# EasyEDA Pro project backup.epro, board PCB_Pre
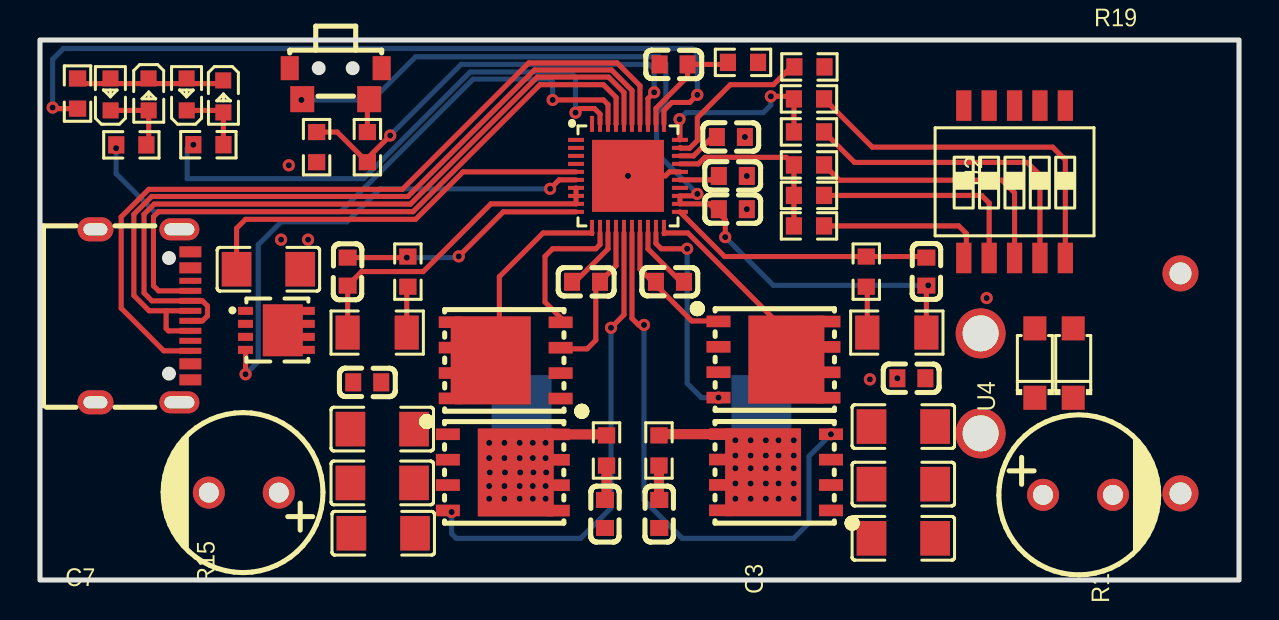
[diagram p10: board, top side]
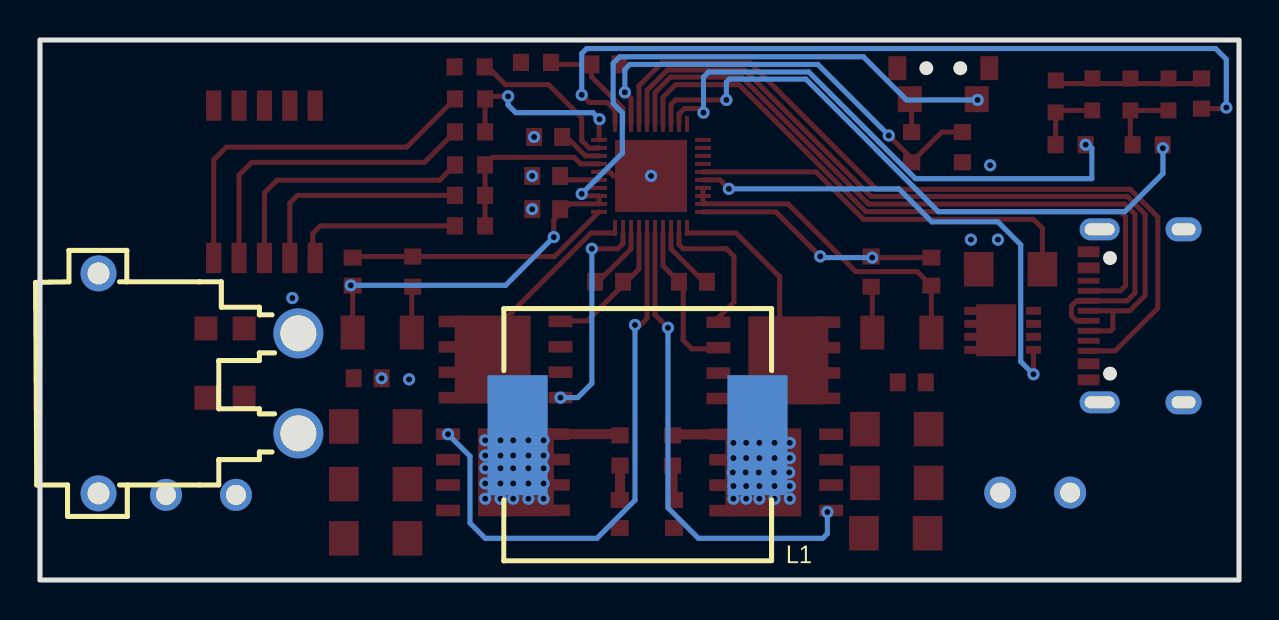
[diagram p11: board, bottom side, seen from below]

Outline 60 x 27 mm; copper layers: Top Layer, Inner1, Inner2, Bottom Layer. Coordinates in mm from the lower left corner of the outline.
Outline path: rectangle 0,27 60,0
Stack: Top Layer 0.035mm 外层铜厚1oz / Dielectric1 0.2104mm 7628 RC49% 8.6mil / Inner1 0.0152mm 内层铜厚 / Dielectric2 1.065mm 1.1mm H/HOZ 含铜 / Inner2 0.0152mm 内层铜厚 / Dielectric3 0.2104mm 7628 RC49% 8.6mil / Bottom Layer 0.035mm 外层铜厚1oz

## Design rules (mm)
template: 自定义配置
spacing copperThickness1oz (default): track to track 0.102, other pairs 0.152 to 0.3
spacing copperThickness2oz: track to track 0.203, other pairs 0.152 to 0.3
spacing 6mil: track to track 0.102, other pairs 0.152 to 0.152
track width copperThickness1oz (default): min 0.127, default 0.254, max 2.54
track width copperThickness2oz: min 0.203, default 0.254, max 2.54
track width 10mil: min 0.254, default 0.254, max 2.54
track width 20mil: min 0.508, default 0.508, max 2.54
differential pair differentialPair (default): width min 0.127, default 0.254, max 2.54; gap min 0.152, default 0.152
differential pair err=5mil: width min 0.127, default 0.254, max 2.54; gap min 0.152, default 0.254
via viaSize (default): diameter min 0.5, default 0.61, max 10; hole min 0.3, default 0.305, max 6.299
via 12-24: diameter min 0.5, default 0.61, max 10; hole min 0.3, default 0.305, max 6.299

## Placement (name value [footprint] x y rotation side)
C1  100nF  [C0603]  27.32 14.91 180 top
C2  100nF  [C0603]  31.52 14.91 0 top
C3  3.3nF  [C0603]  28.27 3.3 90 top
C4  3.3nF  [C0603]  30.99 3.3 90 top
C7  22uF  [C1206]  17.13 4.85 180 top
C8  22uF  [C1206]  17.18 2.34 180 top
C10  100nF  [C0603]  16.38 9.88 180 top
C11  22uF  [C1206]  17.13 7.55 180 top
C15  100nF  [C0603]  43.6 10.09 0 top
C17  22uF  [C1206]  43.2 4.79 0 top
C18  22uF  [C1206]  43.2 2.08 0 top
C19  22uF  [C1206]  43.2 7.67 0 top
C20  2.2uF  [C0603]  34.67 20.2 0 top
C21  2.2uF  [C0603]  34.67 18.54 0 top
C22  100nF  [C0603]  31.71 25.78 180 top
C23  2.2uF  [C0603]  34.57 22.15 0 top
C29  470nF  [C0603]  15.39 15.42 90 top
C30  470nF  [C0603]  44.35 15.42 270 top
C31  22uF  [C1206]  11.43 15.54 0 top
C32  100uF/50V  [CAP-TH_BD8.0-P3.50-D0.6-FD]  10.2 4.37 180 top
C33  100uF/50V  [CAP-TH_BD8.0-P3.50-D0.6-FD]  51.94 4.26 0 top
CN1  XT30PW-M  [CONN-TH_XT30PW-M]  52.07 9.83 270 bottom
L1  22uH  [IND-SMD_L13.45-W12.6]  30.1 7.24 0 bottom
LED1  NCD0603R1  [LED0603-RD_RED]  9.17 24.18 270 top
LED2  NCD0603R1  [LED0603-RD_RED]  7.34 24.28 90 top
LED3  NCD0603R1  [LED0603-RD_RED]  5.44 24.28 270 top
LED4  NCD0603R1  [LED0603-RD_RED]  3.53 24.28 90 top
Q1  RU3030M2  [PDFN3333-8_L3.1-W3.2-P0.65-LS3.4-BL]  11.82 12.48 270 top
R1  2Ω  [R0603]  28.35 6.48 90 top
R2  2Ω  [R0603]  30.97 6.48 90 top
R7  51Ω  [R0603]  18.41 15.42 90 top
R8  5mΩ  [R1206]  16.87 12.37 0 top
R9  10Ω  [R0603]  41.35 15.42 90 top
R10  5mΩ  [R1206]  42.88 12.37 0 top
R11  100Ω  [R0603]  8.43 21.76 0 top
R12  100Ω  [R0603]  4.57 21.76 0 top
R13  100Ω  [R0603]  1.88 24.32 90 top
R14  10kΩ  [R0603]  35.18 25.88 0 top
R15  43kΩ  [R0603]  16.38 21.64 270 top
R16  10kΩ  [R0603]  13.84 21.64 90 top
R17  27kΩ  [R0603]  38.5 25.65 0 top
R18  3.6kΩ  [R0603]  38.48 24.06 0 top
R19  9.1kΩ  [R0603]  38.48 22.4 0 top
R20  27kΩ  [R0603]  38.48 20.75 0 top
R21  13kΩ  [R0603]  38.48 19.23 0 top
R22  9.1kΩ  [R0603]  38.48 17.7 0 top
SW1  TS24CA  [SW-SMD_TS24CA]  14.8 24.82 0 top
U1  -  [IP2366]  26.92 17.71 0 top
U2  AGM40P100A  [DFN-8_L5.8-W4.9-P1.27-LS6.0-BL-1]  23.3 10.98 90 top
U3  AGM40P100A  [DFN-8_L5.8-W4.9-P1.27-LS6.0-BL-1]  36.7 11.02 270 top
U4  AGM40P100A  [DFN-8_L5.8-W4.9-P1.27-LS6.0-BL-1]  23.16 5.38 270 top
U5  AGM40P100A  [DFN-8_L5.8-W4.9-P1.27-LS6.0-BL-1]  36.83 5.39 90 top
U7  SMF30A  [SOD-123FL_L2.7-W1.8-LS3.7-RD]  49.78 10.85 90 top
U8  SMF30A  [SOD-123FL_L2.7-W1.8-LS3.7-RD]  51.7 10.85 90 top
U9  DSHP05TSGER  [SW-SMD_10P-P1.27-L7.8-W5.4]  48.77 19.91 0 top
USB1  TYPE-C 16PIN 2MD(073)  [USB-C-SMD_TYPE-C-6PIN-2MD-073]  5.15 13.21 270 top

## Footprints (pads in the part's own frame, mm; a bottom-side part is the same pattern mirrored in y, then rotated)
C0603
  rect 0.8x0.9 smd: 1(-0.7,0) 2(0.7,0)
C1206
  rect 1.485x1.728 smd: 1(-1.593,0) 2(1.593,0)
CAP-TH_BD8.0-P3.50-D0.6-FD
  round 1.6 hole 1: 1(-1.75,0) 2(1.75,0)
CONN-TH_XT30PW-M
  round 2.5 hole 1.8: 1(-2.5,5) 2(2.5,5)
  round 1.8 hole 1.1: 3(5.5,-5) 4(-5.5,-5)
DFN-8_L5.8-W4.9-P1.27-LS6.0-BL-1
  rect 0.58x1.2 smd: 1(-1.907,-2.75) 2(-0.637,-2.75) 3(0.632,-2.75) 4(1.903,-2.75) 5(1.907,2.75) 6(0.637,2.75) 7(-0.632,2.75) 8(-1.903,2.75)
  rect 4.4x3.8 smd: 9(0,0.646)
IND-SMD_L13.45-W12.6
  rect 3x6 smd: 1(-6,0) 2(6,0)
IP2366
  rect 0.8x0.2 smd: 1(-0.1,4.3) 2(-0.1,3.9) 3(-0.1,3.5) 4(-0.1,3.1) 5(-0.1,2.7) 6(-0.1,2.3) 7(-0.1,1.9) 8(-0.1,1.5) 9(-0.1,1.1) 10(-0.1,0.7) 21(5.1,0.7) 22(5.1,1.1) 23(5.1,1.5) 24(5.1,1.9) 25(5.1,2.3) 26(5.1,2.7) 27(5.1,3.1) 28(5.1,3.5) 29(5.1,3.9) 30(5.1,4.3)
  rect 0.2x0.8 smd: 11(0.7,-0.1) 12(1.1,-0.1) 13(1.5,-0.1) 14(1.9,-0.1) 15(2.3,-0.1) 16(2.7,-0.1) 17(3.1,-0.1) 18(3.5,-0.1) 19(3.9,-0.1) 20(4.3,-0.1) 31(4.3,5.1) 32(3.9,5.1) 33(3.5,5.1) 34(3.1,5.1) 35(2.7,5.1) 36(2.3,5.1) 37(1.9,5.1) 38(1.5,5.1) 39(1.1,5.1) 40(0.7,5.1)
  rect 3.6x3.6 smd: 41(2.5,2.5)
LED0603-RD_RED
  rect 0.8x0.8 smd: 1(-0.799,-0.004) 2(0.799,0.004)
PDFN3333-8_L3.1-W3.2-P0.65-LS3.4-BL
  rect 0.4x0.75 smd: 1(-0.975,-1.534) 2(-0.325,-1.534) 3(0.325,-1.534) 4(0.975,-1.534)
  rect 0.4x0.8 smd: 5(0.975,1.534) 6(0.325,1.534) 7(-0.325,1.534) 8(-0.975,1.534)
  rect 2.6x2 smd: 9(-0.004,0.333)
R0603
  rect 0.806x0.864 smd: 1(-0.753,0) 2(0.753,0)
R1206
  rect 1.208x1.701 smd: 1(-1.479,0) 2(1.479,0)
SOD-123FL_L2.7-W1.8-LS3.7-RD
  rect 1.2x1.15 smd: 1(-1.735,0) 2(1.735,0)
SW-SMD_10P-P1.27-L7.8-W5.4
  rect 0.762x1.524 smd: 1(-2.54,-3.81) 2(-1.27,-3.81) 3(0,-3.81) 4(1.27,-3.81) 5(2.54,-3.81) 6(2.54,3.81) 7(1.27,3.81) 8(0,3.81) 9(-1.27,3.81) 10(-2.54,3.81)
SW-SMD_TS24CA
  rect 0.9x1.2 smd: 1(-2.3,0.775) 2(2.3,0.775)
  rect 1.2x1.3 smd: 3(-1.675,-0.775) 4(1.675,-0.775)
USB-C-SMD_TYPE-C-6PIN-2MD-073
  rect 0.55x1.1 smd: 1(-3.2,2.375) 2(-2.4,2.375) 11(2.4,2.375) 12(3.2,2.375)
  rect 0.3x1.1 smd: 3(-1.75,2.375) 4(-1.25,2.375) 5(-0.75,2.375) 6(-0.25,2.375) 7(0.25,2.375) 8(0.75,2.375) 9(1.25,2.375) 10(1.75,2.375)
  oval 1.1x2 hole 0.6x1.5: 13(-4.325,1.825) 14(4.325,1.825)
  oval 1.2x1.8 hole 0.6x1.2: 13(-4.325,-2.375) 14(4.325,-2.375)

## Nets
As in the schematic.

Pads without a net: U1 1 2 3 4 24 40; USB1 3 9

## Via types
v1: diameter 0.61, hole 0.305, Top Layer to Bottom Layer, 84 vias

## Routing (per net, layer and track width the routed paths; a pad name or vN(x,y) marks a point on that pad's centre or on a via; arc(x,y) is an arc through that point)
GND: length 2.7
  Top Layer w0.254: v1(29.42,20.21) 31.3,20.21 31.5,20.41 U1.26
  vias: v1(12.06,17.02) v1(12.45,20.74) v1(13.42,17.02) v1(35.27,22.15) v1(35.37,20.2) v1(35.37,18.54) v1(41.53,10.03) v1(42.9,10.09) v1(47.37,14.1)
VBUS: length 20.2
  Top Layer w0.254: U1.5 21.17,20.41 18.8,18.03 10.29,18.03 9.84,17.58 C31.1
$C1_1: length 10
  Top Layer w0.254: 28.82,17.35 28.82,15.71 C1.1 27.81,14.7 27.81,11.99 27.38,11.56 26.53,11.56 26.35,11.73
  Top Layer w0.508: U4.8 28.3,7.28 R1.2
  vias: v1(22.48,6.86) v1(22.48,6.1) v1(22.48,4.7) v1(22.48,4.06) v1(22.51,5.38) v1(23.24,6.86) v1(23.24,6.1) v1(23.27,5.38) v1(23.24,4.7) v1(23.24,4.06) v1(24,6.86) v1(24,6.1) v1(24.03,5.38) v1(24,4.7) v1(24,4.06) v1(24.66,6.86) v1(24.66,6.1) v1(24.66,4.7) v1(24.66,4.06) v1(24.69,5.38) v1(25.3,6.86) v1(25.3,6.1) v1(25.33,5.38) v1(25.3,4.7) v1(25.3,4.06)
$C1_2: length 3.3
  Top Layer w0.254: 28.42,17.35 28.42,16.56 26.78,14.91 C1.2
$C2_1: length 10.1
  Top Layer w0.254: 30.66,14.91 32.62,12.95 33.9,12.95 33.95,13.01 ; 30.66,14.91 C2.1 ; 30.66,14.91 30.02,15.55 30.02,17.35
  Top Layer w0.508: R2.2 31.04,7.29 U5.5
  vias: v1(34.8,6.98) v1(34.8,6.22) v1(34.8,5.59) v1(34.8,4.83) v1(34.8,4.06) v1(35.56,6.98) v1(35.56,6.22) v1(35.56,5.59) v1(35.56,4.83) v1(35.56,4.06) v1(36.32,6.98) v1(36.32,6.22) v1(36.32,5.59) v1(36.32,4.83) v1(36.32,4.06) v1(36.96,6.98) v1(36.96,6.22) v1(36.96,5.59) v1(36.96,4.83) v1(36.96,4.06) v1(37.72,6.98) v1(37.72,6.22) v1(37.72,5.59) v1(37.72,4.83) v1(37.72,4.06)
$C2_2: length 3.3
  Top Layer w0.254: 30.42,17.35 30.42,16.56 32.07,14.91 C2.2
$C3_2: length 1.8
  Top Layer w0.508: R1.1 28.35,4.08 28.27,4
$C4_2: length 1.7
  Top Layer w0.508: R2.1 30.97,4.02 30.99,4
$C7_2: length 16.3
  Top Layer w0.254: U1.7 U1.8 U1.9 22.56,18.81 19.18,15.42 16.09,15.42 C29.1 R8.1
$C20_1: length 1.9
  Top Layer w0.254: U1.25 33.6,20.01 33.84,20.25
$C23_1: length 2.2
  Top Layer w0.254: C23.1 33.65,22.15 32.71,21.21 U1.28
$C29_2: length 12.5
  Top Layer w0.254: v1(20.95,16.18) 23.18,18.41 U1.10 ; R7.2 v1(18.36,16.12) C29.2
  Bottom Layer w0.254: v1(20.95,16.18) 20.89,16.12 v1(18.36,16.12)
$C30_1: length 13.3
  Top Layer w0.254: C30.1 44.3,16.17 R9.2 34.26,16.17 U1.21
$LED1_1: length 7.3
  Top Layer w0.254: 9.08,25.08 LED1.1 ; 2.01,24.82 9.2,24.82
$LED1_2: length 3.5
  Top Layer w0.254: LED2.1 9.08,23.48 LED1.2 9.18,21.77 R11.2
$LED3_2: length 3.7
  Top Layer w0.254: R12.2 5.44,21.87 LED3.2 LED4.1
$Q1_4: length 25.2
  Top Layer w0.254: Q1.4 10.29,11.5 v1(10.29,10.29) ; v1(25.53,19.56) 25.97,20.01 U1.6
  Bottom Layer w0.254: v1(25.53,19.56) 17.02,19.56 15.37,17.91 12.06,17.91 10.92,16.76 10.92,10.92 v1(10.29,10.29)
$R7_1: length 2.3
  Top Layer w0.254: 18.35,12.37 18.35,14.61 R7.1
$R9_1: length 2.3
  Top Layer w0.254: R9.1 41.4,14.62 R10.1
$R15_1: length 1.7
  Top Layer w0.254: R15.1 16.38,23.95 SW1.4
$R17_1: length 8.1
  Top Layer w0.254: U1.29 32.04,21.63 32.08,21.59 32.51,21.59 32.89,21.97 32.89,23.11 34.55,24.77 36.7,24.77 37.59,25.65 R17.1
$R18_2: length 18.2
  Top Layer w0.254: R18.2 41.65,21.64 50.67,21.64 51.31,21.01 U9.5
$R19_2: length 15.8
  Top Layer w0.254: R19.2 40.76,20.88 49.4,20.88 50.04,20.25 U9.4
$R20_2: length 13.4
  Top Layer w0.254: U9.3 48.77,19.36 48.13,19.99 40,19.99 R20.2
$R21_2: length 11.2
  Top Layer w0.254: R21.2 47.12,19.23 47.5,18.85 U9.2
$R22_2: length 8.6
  Top Layer w0.254: U9.1 46.36,16.23 46.36,17.32 45.97,17.7 R22.2
$U1_11: length 13.4
  Top Layer w0.254: 27.62,17.35 25.17,17.35 22.99,15.17 22.99,11.13 22.96,11.1 ; 20.68,12.75 20.68,8.94
$U1_20: length 9.5
  Top Layer w0.254: 31.22,17.35 32.42,17.35 37.35,12.42 37.35,11.1
BAT: length 45.1
  Top Layer w0.254: v1(32.89,19.3) 32.79,19.21 U1.23 U1.22 33.5,18.81 34.29,18.02 v1(34.29,17.14) ; C30.2 R10.2
  Bottom Layer w0.254: v1(32.89,19.3) 30.86,21.34 30.86,23.37 31.32,23.83 31.32,25.83 30.99,26.16 18.8,26.16 16.64,24 v1(13.08,24) ; v1(34.29,17.14) 36.7,14.73 v1(44.45,14.73)
BATC: length 9.2
  Top Layer w0.254: U1.30 32.02,23.02 v1(32,23.04) ; R19.1 R18.1 37.6,24.18 v1(36.57,24.18)
  Bottom Layer w0.254: v1(32,23.04) 32.33,23.37 36.2,23.37 36.57,23.75 v1(36.57,24.18)
BATNU: length 9
  Top Layer w0.254: U1.27 32.95,20.81 33.27,21.13 37.35,21.13 R20.1 R21.1 R22.1
CC1: length 32.9
  Top Layer w0.254: U1.37 28.83,22.81 28.83,24.13 28.19,24.77 25.02,24.77 18.67,18.42 5.93,18.42 5.68,18.16 5.68,14.71 5.93,14.46 USB1.4
CC2: length 40.4
  Top Layer w0.254: USB1.10 6.2,11.46 4.06,13.59 4.06,18.16 5.44,19.53 18.14,19.53 24.46,25.86 28.88,25.86 30.02,24.71 U1.34
DM: length 37.6
  Top Layer w0.254: USB1.7 7.53,12.95 8.13,12.95 8.38,13.21 8.38,13.7 8.13,13.96 USB1.5 5.6,13.96 5.21,14.35 5.21,18.29 5.71,18.8 18.54,18.8 24.89,25.15 28.45,25.15 29.22,24.38 U1.36
DP: length 39.4
  Top Layer w0.254: 6.31,13.46 7.52,13.46 USB1.6 ; 6.31,13.46 5.46,13.46 4.7,14.22 4.7,18.29 5.59,19.18 18.42,19.18 24.74,25.5 28.6,25.5 29.62,24.48 U1.35 ; 6.31,13.46 6.31,12.57 6.43,12.46 USB1.8
EN: length 22.6
  Top Layer w0.254: R16.2 14.88,22.4 R15.2 16.38,21.08 v1(17.53,22.23) ; U1.33 30.42,24.07 v1(30.73,24.38)
  Bottom Layer w0.254: v1(30.73,24.38) 30.73,25.53 30.48,25.78 21.08,25.78 17.53,22.23 v1(17.53,22.23)
HG1: length 7.3
  Top Layer w0.254: 26.35,13 26.16,13 25.27,13.89 25.27,16.18 25.65,16.56 27.81,16.56 28.02,16.77 28.02,17.35
HG2: length 10.8
  Top Layer w0.254: 30.82,17.35 30.82,16.82 31.09,16.56 v1(32.39,16.56)
  Bottom Layer w0.254: v1(33.95,9.12) 33.1,9.12 32.39,9.83 v1(32.39,16.56)
LED1: length 27.1
  Top Layer w0.254: U1.39 28.02,23.3 27.75,23.57 27,23.57 v1(26.8,23.37)
  Bottom Layer w0.254: 7.49,21.72 7.37,21.59 7.37,20.07 16.19,20.07 21.53,25.4 26.54,25.4 26.8,25.15 v1(26.8,23.37)
  vias: v1(7.67,21.76)
LED2: length 31.4
  Top Layer w0.254: U1.38 28.42,23.77 28.19,24 v1(25.65,24)
  Bottom Layer w0.254: v1(3.81,21.59) 3.81,20.32 5.71,18.42 15.05,18.42 21.67,25.04 25.5,25.04 25.65,24.89 v1(25.65,24)
LED3: length 41
  Top Layer w0.254: U1.31 31.22,23.48 31.62,23.88 32.51,23.88 v1(32.89,24.26) ; R13.1 0.69,23.57 v1(0.63,23.62)
  Bottom Layer w0.254: v1(0.63,23.62) 0.63,26.03 1.17,26.57 32.64,26.57 32.89,26.32 v1(32.89,24.26)
LG1: length 23.8
  Top Layer w0.254: v1(28.58,12.61) 29.22,13.26 29.22,17.35
  Bottom Layer w0.254: v1(20.6,3.4) 20.6,2.31 20.83,2.08 27.05,2.08 28.58,3.61 v1(28.58,12.61)
LG2: length 28
  Top Layer w0.254: 29.62,17.35 29.62,13.08 29.95,12.75 v1(30.23,12.75)
  Bottom Layer w0.254: v1(30.23,12.75) 30.23,3.99 32.13,2.08 37.72,2.08 38.48,2.85 38.48,6.19 v1(39.58,7.29)
NTC: length 5.6
  Top Layer w0.254: 34.35,25.71 34.27,25.78 C22.1 32.41,25.17 30.82,23.59 U1.32

## Copper pours and planes (outline as drawn; the poured copper is in the pictures)
GND on Top Layer: -3.68,29.84 68.71,29.84 68.71,-9.27 -3.68,-9.27
GND on Bottom Layer: -4.95,33.02 68.71,33.02 68.71,-5.46 -4.95,-5.46
GND on Inner1: 0.26,26.74 59.74,26.74 59.74,0.26 0.26,0.26
GND on Inner2: 0.26,26.74 59.74,26.74 59.74,0.26 0.26,0.26
VBUS on Top Layer: 8.03,15.91 8.76,16.63 10.92,16.63 10.92,11.82 9.66,11.82 9.65,11.81 9.65,10.67 9.4,10.41 6.84,10.41 6.84,11.16 6.86,11.18 8.63,11.18 8.63,13.02 8.64,13.02 8.64,15.24 6.98,15.24 6.98,15.91
$C1_1 on Top Layer: 25.4,11.94 26.54,11.94 26.54,3.07 21.95,3.07 21.84,3.17 21.84,8.56 24.64,8.56 24.64,11.95 25.41,11.95
$C2_1 on Top Layer: 32.51,13.27 34.91,13.27 34.91,9.53 33.4,9.53 33.27,9.4 33.27,8.25 33.53,8 35.94,8 36.07,7.87 38.67,7.87 38.67,2.35 38.73,2.29 33.78,2.29 33.65,2.41 33.65,6.14 32.72,6.14 32.26,6.6 32.26,13.07 32.51,13.32
$C7_2 on Top Layer: 11.18,13.72 11.18,11.18 14.36,11.18 14.48,11.06 14.48,5.59 14.35,5.46 11.3,5.46 10.67,4.83 10.67,1.14 11.56,0.25 16.89,0.25 17.14,0.51 17.14,8 16.26,8.89 16.26,13.86 11.32,13.86
BAT on Top Layer: 43.86,0.25 52.68,0.25 52.68,9.62 48.2,9.62 45.97,9.55 45.97,10.02 45.85,13.89 45.59,14.15 43.86,14.15
